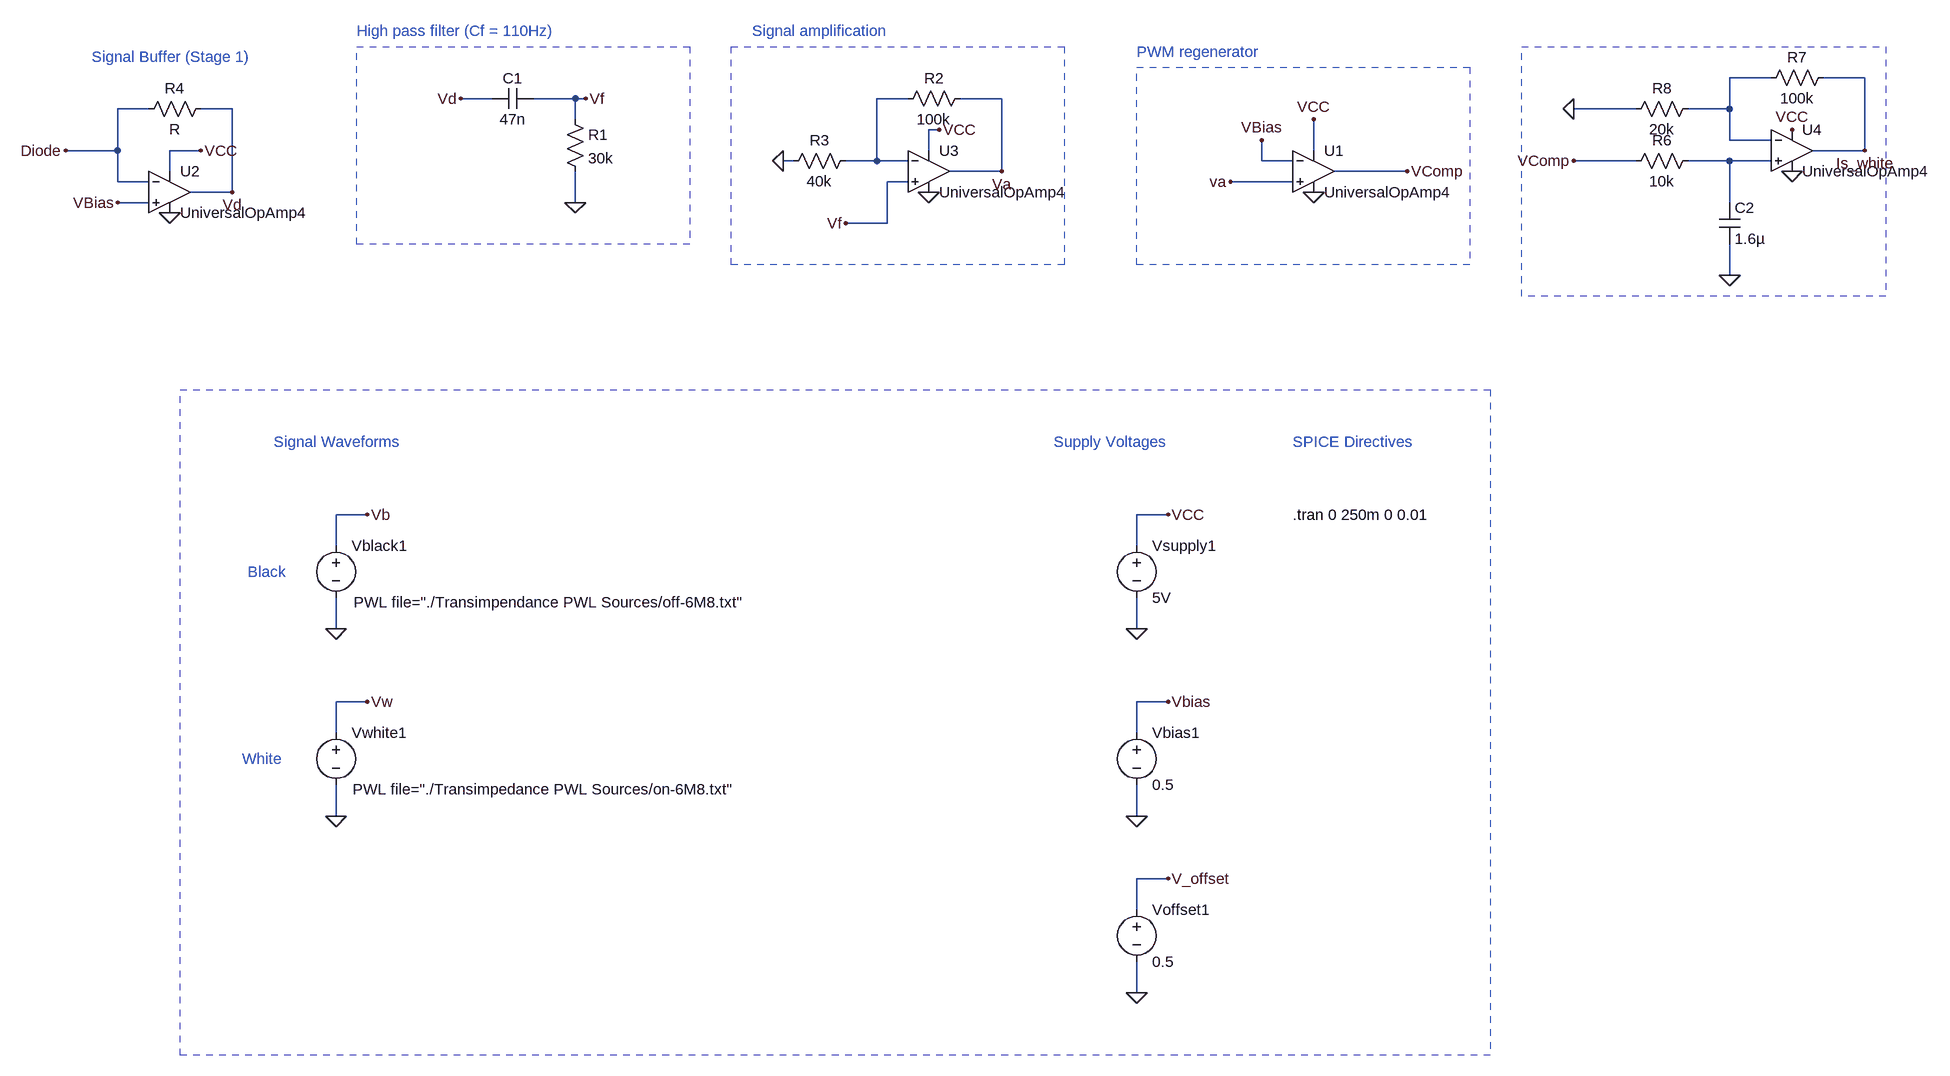
[diagram p0: schematic sensor-diode.asc]
sensor-diode.asc, the LTspice schematic file:
Version 4
SHEET 1 1476 1540
WIRE 1264 32 1200 32
WIRE 1408 32 1344 32
WIRE -704 64 -752 64
WIRE -576 64 -640 64
WIRE -560 64 -576 64
WIRE -64 64 -112 64
WIRE 80 64 16 64
WIRE -1232 80 -1280 80
WIRE -1104 80 -1152 80
WIRE 1056 80 960 80
WIRE 1200 80 1200 32
WIRE 1200 80 1136 80
WIRE -576 96 -576 64
WIRE -16 112 -32 112
WIRE 1200 128 1200 80
WIRE 1264 128 1200 128
WIRE -1280 144 -1280 80
WIRE -1280 144 -1360 144
WIRE -1152 144 -1200 144
WIRE -32 144 -32 112
WIRE 560 144 560 96
WIRE 1408 144 1408 32
WIRE 1408 144 1328 144
WIRE -240 160 -256 160
WIRE -112 160 -112 64
WIRE -112 160 -160 160
WIRE -64 160 -112 160
WIRE 480 160 480 128
WIRE 528 160 480 160
WIRE 1056 160 960 160
WIRE 1200 160 1136 160
WIRE 1264 160 1200 160
WIRE -1200 176 -1200 144
WIRE 80 176 80 64
WIRE 80 176 0 176
WIRE 704 176 592 176
WIRE -1280 192 -1280 144
WIRE -1232 192 -1280 192
WIRE -64 192 -96 192
WIRE 528 192 432 192
WIRE -1104 208 -1104 80
WIRE -1104 208 -1168 208
WIRE -1232 224 -1280 224
WIRE -576 224 -576 176
WIRE 1200 224 1200 160
WIRE -96 256 -96 192
WIRE -96 256 -160 256
WIRE 1200 336 1200 288
WIRE -896 704 -944 704
WIRE 336 704 288 704
WIRE -944 752 -944 704
WIRE 288 752 288 704
WIRE -944 880 -944 832
WIRE 288 880 288 832
WIRE -896 992 -944 992
WIRE 336 992 288 992
WIRE -944 1040 -944 992
WIRE 288 1040 288 992
WIRE -944 1168 -944 1120
WIRE 288 1168 288 1120
WIRE 336 1264 288 1264
WIRE 288 1312 288 1264
WIRE 288 1440 288 1392
FLAG 560 96 VCC
FLAG 480 128 VBias
FLAG 560 208 0
FLAG -752 64 Vd
FLAG -560 64 Vf
FLAG 432 192 va
FLAG -1200 240 0
FLAG -1152 144 VCC
FLAG -1104 208 Vd
FLAG -16 112 VCC
FLAG 80 176 Va
FLAG -32 208 0
FLAG -256 160 0
FLAG 704 176 VComp
FLAG -160 256 Vf
FLAG -576 224 0
FLAG 960 160 VComp
FLAG 1200 336 0
FLAG 960 80 0
FLAG 1296 176 0
FLAG 1296 112 VCC
FLAG 1408 144 Is_white
FLAG -1280 224 VBias
FLAG -1360 144 Diode
FLAG -944 1168 0
FLAG 288 1168 0
FLAG -896 992 Vw
FLAG 336 992 Vbias
FLAG 288 880 0
FLAG 336 704 VCC
FLAG -944 880 0
FLAG -896 704 Vb
FLAG 288 1440 0
FLAG 336 1264 V_offset
SYMBOL OpAmps\\UniversalOpAmp4 560 176 R0
SYMATTR InstName U1
SYMBOL res -592 80 R0
SYMATTR InstName R1
SYMATTR Value 30k
SYMBOL cap -640 48 R90
WINDOW 0 0 32 VBottom 2
WINDOW 3 32 32 VTop 2
SYMATTR InstName C1
SYMATTR Value 47n
SYMBOL OpAmps\\UniversalOpAmp4 -1200 208 R0
SYMATTR InstName U2
SYMBOL OpAmps\\UniversalOpAmp4 -32 176 R0
SYMATTR InstName U3
SYMBOL res 32 48 R90
WINDOW 0 0 56 VBottom 2
WINDOW 3 32 56 VTop 2
SYMATTR InstName R2
SYMATTR Value 100k
SYMBOL res -144 144 R90
WINDOW 0 0 56 VBottom 2
WINDOW 3 32 56 VTop 2
SYMATTR InstName R3
SYMATTR Value 40k
SYMBOL res 1152 144 R90
WINDOW 0 0 56 VBottom 2
WINDOW 3 32 56 VTop 2
SYMATTR InstName R6
SYMATTR Value 10k
SYMBOL cap 1184 224 R0
SYMATTR InstName C2
SYMATTR Value 1.6µ
SYMBOL OpAmps\\UniversalOpAmp4 1296 144 R0
SYMATTR InstName U4
SYMBOL res 1360 16 R90
WINDOW 0 0 56 VBottom 2
WINDOW 3 32 56 VTop 2
SYMATTR InstName R7
SYMATTR Value 100k
SYMBOL res 1152 64 R90
WINDOW 0 0 56 VBottom 2
WINDOW 3 32 56 VTop 2
SYMATTR InstName R8
SYMATTR Value 20k
SYMBOL res -1136 64 R90
WINDOW 0 0 56 VBottom 2
WINDOW 3 32 56 VTop 2
SYMATTR InstName R4
SYMBOL voltage 288 1024 R0
WINDOW 123 0 0 Left 0
WINDOW 39 0 0 Left 0
SYMATTR InstName Vbias1
SYMATTR Value 0.5
SYMBOL voltage -944 1024 R0
WINDOW 123 0 0 Left 0
WINDOW 39 -205 89 Left 2
WINDOW 3 26 103 Left 2
SYMATTR Value PWL file="./Transimpedance PWL Sources/on-6M8.txt"
SYMATTR InstName Vwhite1
SYMBOL voltage 288 736 R0
WINDOW 123 0 0 Left 0
WINDOW 39 0 0 Left 0
SYMATTR InstName Vsupply1
SYMATTR Value 5V
SYMBOL voltage -944 736 R0
WINDOW 123 0 0 Left 0
WINDOW 39 0 0 Left 0
WINDOW 3 27 103 Left 2
SYMATTR Value PWL file="./Transimpendance PWL Sources/off-6M8.txt"
SYMATTR InstName Vblack1
SYMBOL voltage 288 1296 R0
WINDOW 123 0 0 Left 0
WINDOW 39 0 0 Left 0
SYMATTR InstName Voffset1
SYMATTR Value 0.5
TEXT 288 -8 Left 2 ;PWM regenerator
TEXT -912 -40 Left 2 ;High pass filter (Cf = 110Hz)
TEXT -1320 0 Left 2 ;Signal Buffer (Stage 1)
TEXT -304 -40 Left 2 ;Signal amplification
TEXT 528 704 Left 2 !.tran 0 250m 0 0.01
TEXT -1080 792 Left 2 ;Black
TEXT -1088 1080 Left 2 ;White
TEXT -1040 592 Left 2 ;Signal Waveforms
TEXT 160 592 Left 2 ;Supply Voltages
TEXT 528 592 Left 2 ;SPICE Directives
RECTANGLE Normal 800 320 288 16 2
RECTANGLE Normal -400 288 -912 -16 2
RECTANGLE Normal 1440 368 880 -16 2
RECTANGLE Normal 176 320 -336 -16 2
RECTANGLE Normal 832 1536 -1184 512 2

The netlist it stands for:
* sensor-diode.asc
* U1: UniversalOpAmp4 (symbol OpAmps\UniversalOpAmp4 not available, pins judged from their places): In+=va In-=VBias V+=VCC V-=0 OUT=VComp
R1 Vf 0 30k
C1 Vf Vd 47n
* U2: UniversalOpAmp4 (symbol OpAmps\UniversalOpAmp4 not available, pins judged from their places): In+=VBias In-=Diode V+=VCC V-=0 OUT=Vd
* U3: UniversalOpAmp4 (symbol OpAmps\UniversalOpAmp4 not available, pins judged from their places): In+=Vf In-=N002 V+=VCC V-=0 OUT=va
R2 va N002 100k
R3 N002 0 40k
R6 N003 VComp 10k
C2 N003 0 1.6µ
* U4: UniversalOpAmp4 (symbol OpAmps\UniversalOpAmp4 not available, pins judged from their places): In+=N003 In-=N001 V+=VCC V-=0 OUT=Is_white
R7 Is_white N001 100k
R8 N001 0 20k
R4 Vd Diode R
Vbias1 VBias 0 0.5
Vwhite1 Vw 0 PWL file="./Transimpedance PWL Sources/on-6M8.txt"
Vsupply1 VCC 0 5V
Vblack1 Vb 0 PWL file="./Transimpendance PWL Sources/off-6M8.txt"
Voffset1 V_offset 0 0.5
* PWM regenerator
* High pass filter (Cf = 110Hz)
* Signal Buffer (Stage 1)
* Signal amplification
.tran 0 250m 0 0.01
* Black
* White
* Signal Waveforms
* Supply Voltages
* SPICE Directives
.backanno
.end